# Altium schematic sheet MC_Connector.SchDoc
size Letter; DocumentNumber: D_16; SheetNumber: 16; SheetTotal: 21
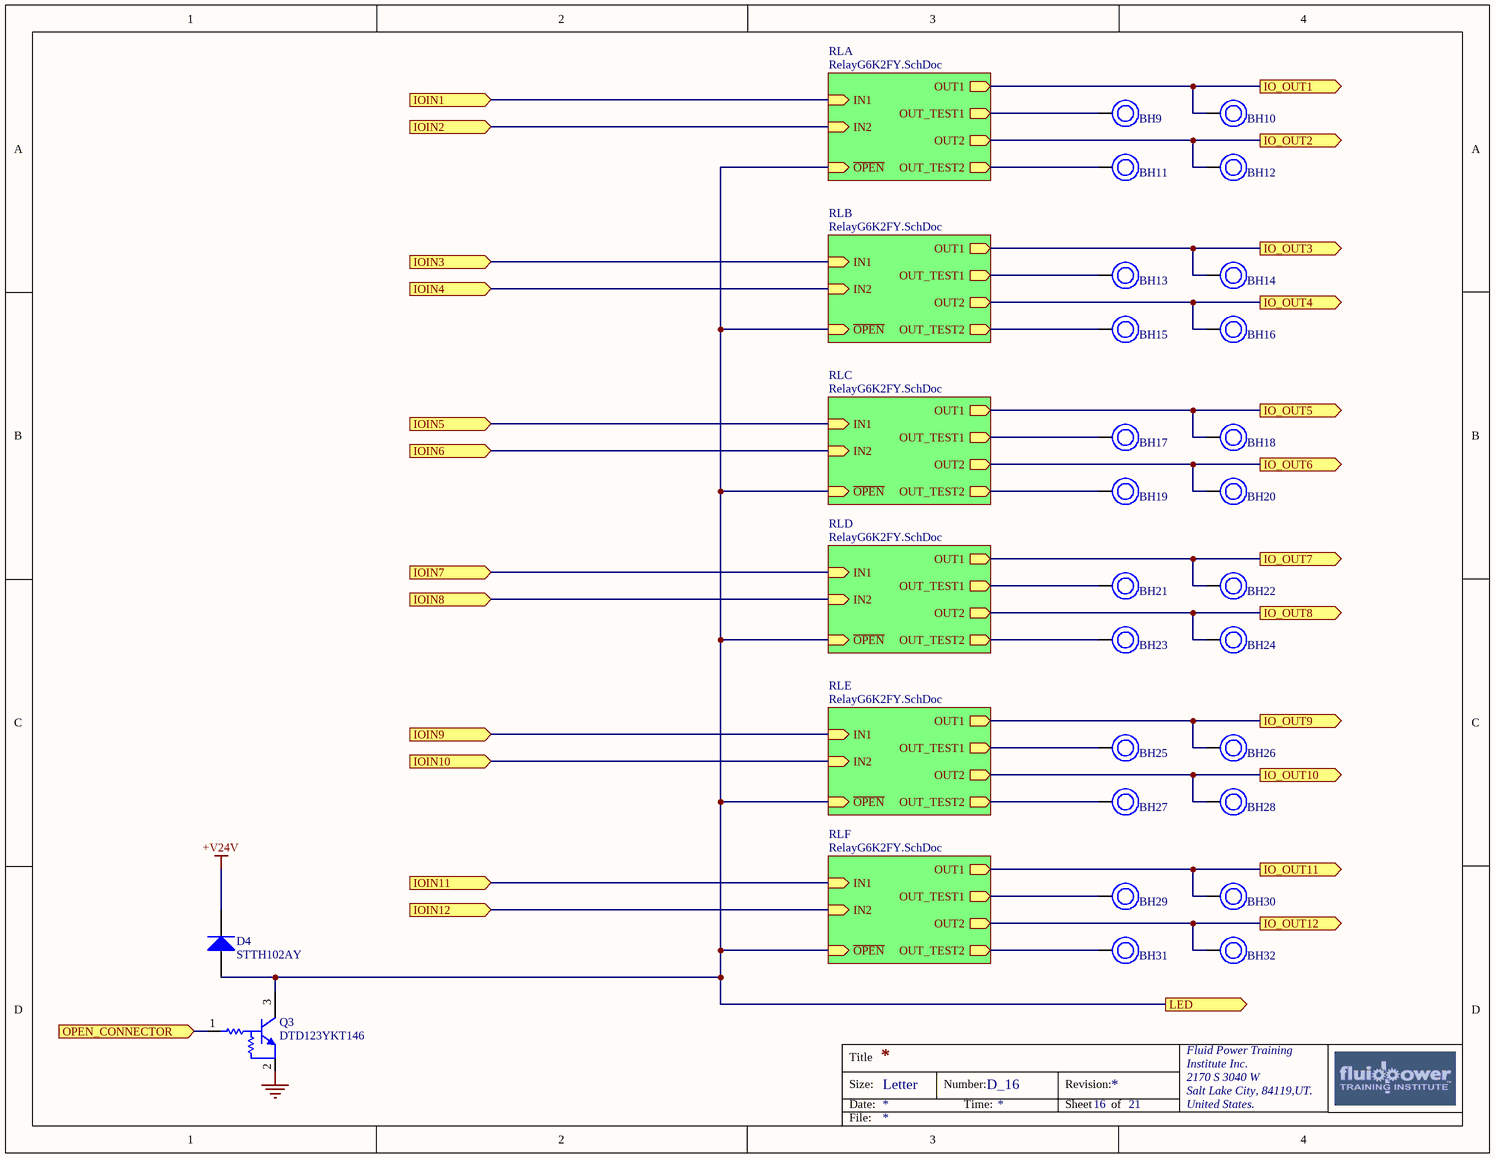
[diagram p0: MC_Connector.SchDoc]

## Parts
BH9  BananaHole  [BananaHole]  (value not drawn)  (no BOM)
BH10  BananaHole  [BananaHole]  (value not drawn)  (no BOM)
BH11  BananaHole  [BananaHole]  (value not drawn)  (no BOM)
BH12  BananaHole  [BananaHole]  (value not drawn)  (no BOM)
BH13  BananaHole  [BananaHole]  (value not drawn)  (no BOM)
BH14  BananaHole  [BananaHole]  (value not drawn)  (no BOM)
BH15  BananaHole  [BananaHole]  (value not drawn)  (no BOM)
BH16  BananaHole  [BananaHole]  (value not drawn)  (no BOM)
BH17  BananaHole  [BananaHole]  (value not drawn)  (no BOM)
BH18  BananaHole  [BananaHole]  (value not drawn)  (no BOM)
BH19  BananaHole  [BananaHole]  (value not drawn)  (no BOM)
BH20  BananaHole  [BananaHole]  (value not drawn)  (no BOM)
BH21  BananaHole  [BananaHole]  (value not drawn)  (no BOM)
BH22  BananaHole  [BananaHole]  (value not drawn)  (no BOM)
BH23  BananaHole  [BananaHole]  (value not drawn)  (no BOM)
BH24  BananaHole  [BananaHole]  (value not drawn)  (no BOM)
BH25  BananaHole  [BananaHole]  (value not drawn)  (no BOM)
BH26  BananaHole  [BananaHole]  (value not drawn)  (no BOM)
BH27  BananaHole  [BananaHole]  (value not drawn)  (no BOM)
BH28  BananaHole  [BananaHole]  (value not drawn)  (no BOM)
BH29  BananaHole  [BananaHole]  (value not drawn)  (no BOM)
BH30  BananaHole  [BananaHole]  (value not drawn)  (no BOM)
BH31  BananaHole  [BananaHole]  (value not drawn)  (no BOM)
BH32  BananaHole  [BananaHole]  (value not drawn)  (no BOM)
D4  STTH102AY  [DIOM4326X26M]
Q3  DTD123YKT146  [SOT95P280X130-3N]

## Sub-sheets
RLA = RelayG6K2FY.SchDoc: IN2 (in), IN1 (in), OUT2 (out), OUT1 (out), OUT_TEST1 (out), OUT_TEST2 (out), ~{OPEN} (in)
RLB = RelayG6K2FY.SchDoc: IN2 (in), IN1 (in), OUT2 (out), OUT1 (out), OUT_TEST1 (out), OUT_TEST2 (out), ~{OPEN} (in)
RLC = RelayG6K2FY.SchDoc: IN2 (in), IN1 (in), OUT2 (out), OUT1 (out), OUT_TEST1 (out), OUT_TEST2 (out), ~{OPEN} (in)
RLD = RelayG6K2FY.SchDoc: IN2 (in), IN1 (in), OUT2 (out), OUT1 (out), OUT_TEST1 (out), OUT_TEST2 (out), ~{OPEN} (in)
RLE = RelayG6K2FY.SchDoc: IN2 (in), IN1 (in), OUT2 (out), OUT1 (out), OUT_TEST1 (out), OUT_TEST2 (out), ~{OPEN} (in)
RLF = RelayG6K2FY.SchDoc: IN2 (in), IN1 (in), OUT2 (out), OUT1 (out), OUT_TEST1 (out), OUT_TEST2 (out), ~{OPEN} (in)

## Ports
IO_OUT1 (out), IO_OUT2 (out), IO_OUT3 (out), IO_OUT4 (out), IO_OUT5 (out), IO_OUT6 (out), IO_OUT7 (out), IO_OUT8 (out), IO_OUT9 (out), IO_OUT10 (out), IO_OUT11 (out), IO_OUT12 (out), IOIN1 (in), IOIN2 (in), IOIN3 (in), IOIN4 (in), IOIN5 (in), IOIN6 (in), IOIN7 (in), IOIN8 (in), IOIN9 (in), IOIN10 (in), IOIN11 (in), IOIN12 (in), LED (out), OPEN_CONNECTOR (in)

## Nets
+V24V: D4.1(K)
GND: Q3.2(E)
IO_OUT1: BH10.1 ; port IO_OUT1, sheet RLA/OUT1
IO_OUT2: BH12.1 ; port IO_OUT2, sheet RLA/OUT2
IO_OUT3: BH14.1 ; port IO_OUT3, sheet RLB/OUT1
IO_OUT4: BH16.1 ; port IO_OUT4, sheet RLB/OUT2
IO_OUT5: BH18.1 ; port IO_OUT5, sheet RLC/OUT1
IO_OUT6: BH20.1 ; port IO_OUT6, sheet RLC/OUT2
IO_OUT7: BH22.1 ; port IO_OUT7, sheet RLD/OUT1
IO_OUT8: BH24.1 ; port IO_OUT8, sheet RLD/OUT2
IO_OUT9: BH26.1 ; port IO_OUT9, sheet RLE/OUT1
IO_OUT10: BH28.1 ; port IO_OUT10, sheet RLE/OUT2
IO_OUT11: BH30.1 ; port IO_OUT11, sheet RLF/OUT1
IO_OUT12: BH32.1 ; port IO_OUT12, sheet RLF/OUT2
IOIN1: port IOIN1, sheet RLA/IN1
IOIN2: port IOIN2, sheet RLA/IN2
IOIN3: port IOIN3, sheet RLB/IN1
IOIN4: port IOIN4, sheet RLB/IN2
IOIN5: port IOIN5, sheet RLC/IN1
IOIN6: port IOIN6, sheet RLC/IN2
IOIN7: port IOIN7, sheet RLD/IN1
IOIN8: port IOIN8, sheet RLD/IN2
IOIN9: port IOIN9, sheet RLE/IN1
IOIN10: port IOIN10, sheet RLE/IN2
IOIN11: port IOIN11, sheet RLF/IN1
IOIN12: port IOIN12, sheet RLF/IN2
LED: D4.2(A) Q3.3(C) ; port LED, sheet RLA/~{OPEN}, sheet RLB/~{OPEN}, sheet RLC/~{OPEN}, sheet RLD/~{OPEN}, sheet RLE/~{OPEN}, sheet RLF/~{OPEN}
OPEN_CONNECTOR: Q3.1(B) ; port OPEN_CONNECTOR
NetBH9_1: BH9.1 ; sheet RLA/OUT_TEST1
NetBH11_1: BH11.1 ; sheet RLA/OUT_TEST2
NetBH13_1: BH13.1 ; sheet RLB/OUT_TEST1
NetBH15_1: BH15.1 ; sheet RLB/OUT_TEST2
NetBH17_1: BH17.1 ; sheet RLC/OUT_TEST1
NetBH19_1: BH19.1 ; sheet RLC/OUT_TEST2
NetBH21_1: BH21.1 ; sheet RLD/OUT_TEST1
NetBH23_1: BH23.1 ; sheet RLD/OUT_TEST2
NetBH25_1: BH25.1 ; sheet RLE/OUT_TEST1
NetBH27_1: BH27.1 ; sheet RLE/OUT_TEST2
NetBH29_1: BH29.1 ; sheet RLF/OUT_TEST1
NetBH31_1: BH31.1 ; sheet RLF/OUT_TEST2

## Notes on the sheet
- Title
- Size:
- Date:
- Letter
- Number:
- Time:
- Revision:
- Sheet
- of
- Fluid Power Training
- Institute Inc.
- 2170 S 3040 W
- Salt Lake City, 84119,UT.
- United States.
- File:

## Library data of the parts
BH9-BH32 = BananaHole: Banana hole for panel testing and board mounting
D4 = STTH102AY: DIODE GEN PURP 200V 1A SMA; Manufacturer: STMicroelectronics; Reverse Recovery Time: 20ns; Forward Voltage: 970mV; Element Configuration: Single; Peak Non-Repetitive Surge Current: 40A; Peak Reverse Current: 1uA; Max Reverse Leakage Current: 25uA; Supplier 1: Mouser; Supplier Part Number 1: 511-STTH102AY; Manufacturer Part Number: STTH102AY; RoHS: Yes; Category: Rectifier Diodes; Stock 1: 13440; Pricing 1: 1=0.51000, 10=0.38600, 100=0.20900, 1000=0.15700, 5000=0.13500, 10000=0.12700 (USD); Mount: Surface Mount; Number of Pins: 2; Min Operating Temperature: -40°C; Max Operating Temperature: 175°C; Packaging: Tape and Reel; Max Repetitive Reverse Voltage (Vrrm): 200V; Forward Current: 1A; Package Quantity: 5000; Average Rectified Current: 1A; Max Reverse Voltage (DC): 200V; Recovery Time: 20ns; Radiation Hardening: No; Lead Free: Lead Free; ComponentLink1URL: https://datasheet.ciiva.com/12327/cd00285726-211663-12327361.pdf?src-supplier=Mouser; ComponentLink1Description: https://datasheet.ciiva.com/12327/cd00285726-211663-12327361.pdf?src-supplier=Mouser; ComponentLink2URL: https://datasheet.ciiva.com/25949/cd00285726-25949278.pdf?src-supplier=Avnet+Europe; ComponentLink2Description: https://datasheet.ciiva.com/25949/cd00285726-25949278.pdf?src-supplier=Avnet+Europe; ComponentLink3URL: https://datasheet.ciiva.com/915/cd00285726-915840.pdf?src-supplier=Digi-Key; ComponentLink3Description: https://datasheet.ciiva.com/915/cd00285726-915840.pdf?src-supplier=Digi-Key; ComponentLink4URL: https://datasheet.ciiva.com/915/cd00285726-915841.pdf?src-supplier=Digi-Key; ComponentLink4Description: https://datasheet.ciiva.com/915/cd00285726-915841.pdf?src-supplier=Digi-Key; ComponentLink5URL: https://datasheet.ciiva.com/915/cd00285726-915842.pdf?src-supplier=Digi-Key; ComponentLink5Description: https://datasheet.ciiva.com/915/cd00285726-915842.pdf?src-supplier=Digi-Key; Case/Package: SMA
Q3 = DTD123YKT146: TRANS PREBIAS NPN 200MW SMT3; Manufacturer: Rohm; Collector Emitter Voltage (VCEO): 300mV; Element Configuration: Single; hFE Min: 56; Max Collector Current: 500mA; Collector Emitter Breakdown Voltage: 50V; Transition Frequency: 200MHz; Supplier 1: Mouser; Supplier Part Number 1: 755-DTD123YKT146; Manufacturer Part Number: DTD123YKT146; RoHS: Yes; Category: BJTs; Stock 1: 8666; Pricing 1: 1=0.38000, 10=0.28800, 100=0.15600, 1000=0.11700, 3000=0.10100, 9000=0.09500 (USD); Mount: Surface Mount; Case/Package: SMD/SMT; Number of Pins: 3; Min Operating Temperature: -55°C; Max Operating Temperature: 150°C; Packaging: Tape and Reel; Package Quantity: 1; Max Power Dissipation: 200mW; Polarity: NPN; Power Dissipation: 200mW; Max Breakdown Voltage: 50V; Voltage Rating (DC): 50V; Current Rating: 500mA; Termination: SMD/SMT; Max Output Current: 500mA; Operating Supply Voltage: 50V; Continuous Collector Current: 500mA; Length: 2.9mm; Height: 1.1mm; Width: 1.6mm; Radiation Hardening: No; REACH SVHC: No SVHC; Lead Free: Lead Free; ComponentLink1URL: https://datasheet.ciiva.com/6356/dtd123yk-6356016.pdf?src-supplier=Digi-Key; ComponentLink1Description: https://datasheet.ciiva.com/6356/dtd123yk-6356016.pdf?src-supplier=Digi-Key; ComponentLink2URL: https://datasheet.ciiva.com/16616/dtd123yk-16616256.pdf?src-supplier=Avnet+Europe; ComponentLink2Description: https://datasheet.ciiva.com/16616/dtd123yk-16616256.pdf?src-supplier=Avnet+Europe; ComponentLink3URL: https://datasheet.ciiva.com/5782/1645233-5782035.pdf?src-supplier=Farnell; ComponentLink3Description: https://datasheet.ciiva.com/5782/1645233-5782035.pdf?src-supplier=Farnell; ComponentLink4URL: https://datasheet.ciiva.com/16953/0900766b8101ddb2-16953270.pdf?src-supplier=Allied+Electronics; ComponentLink4Description: https://datasheet.ciiva.com/16953/0900766b8101ddb2-16953270.pdf?src-supplier=Allied+Electronics; ComponentLink5URL: https://datasheet.ciiva.com/12316/dtd123yk-210516-12316106.pdf?src-supplier=Mouser; ComponentLink5Description: https://datasheet.ciiva.com/12316/dtd123yk-210516-12316106.pdf?src-supplier=Mouser; ComponentLink6URL: https://datasheet.ciiva.com/8029/1645233-8029419.pdf?src-supplier=Element14; ComponentLink6Description: https://datasheet.ciiva.com/8029/1645233-8029419.pdf?src-supplier=Element14; ComponentLink7URL: https://datasheet.ciiva.com/11210/dtd123yk-11210380.pdf?src-supplier=Avnet; ComponentLink7Description: https://datasheet.ciiva.com/11210/dtd123yk-11210380.pdf?src-supplier=Avnet